# EAGLE design ConnectorHead_RPi (EAGLE 9.6.2)
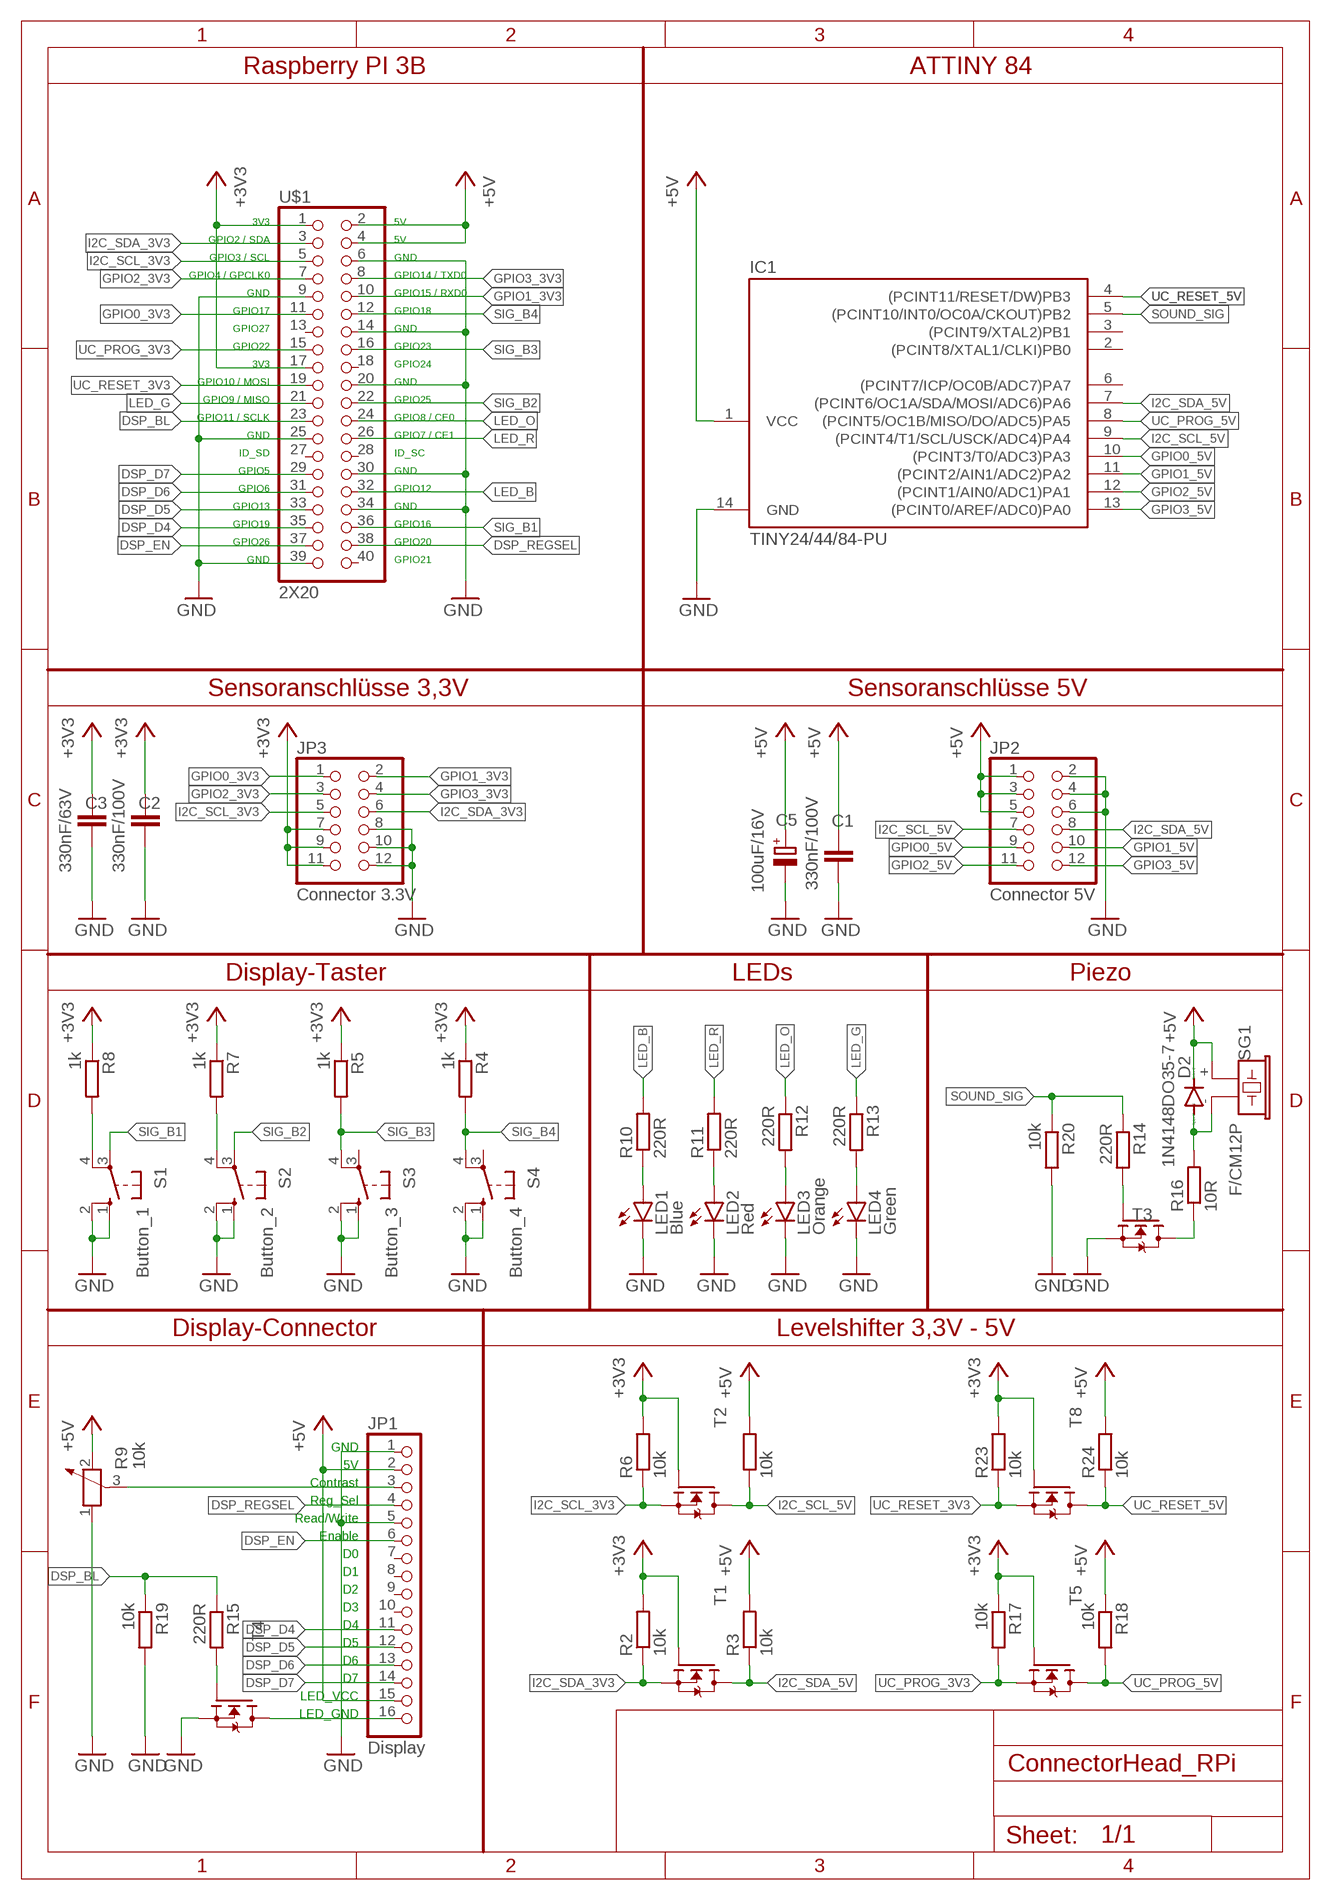
[diagram p0: schematic, sheet 1]

## Parts
C1  330nF/100V  C-EU075-042X103  [C075-042X103]
C2  330nF/100V  C-EU075-042X103  [C075-042X103]
C3  330nF/63V  C-EU050-035X075  [C050-035X075]
C5  100uF/16V  CPOL-EUE2.5-6_FLAT_DOWN  [E2,5-6_FLAT_DOWN]
D2  1N4148DO35-7  [DO35-7]
IC1  TINY24/44/84-PU  [DIL14]
JP1  Display  PINHD-1X16F1X16F  [1X16F]
JP2  Connector 5V  PINHD-2X6/90  [2X06/90]
JP3  Connector 3.3V  PINHD-2X6/90  [2X06/90]
LED1  Blue  LED5MM  [LED5MM]
LED2  Red  LED5MM  [LED5MM]
LED3  Orange  LED5MM  [LED5MM]
LED4  Green  LED5MM  [LED5MM]
R1  10k  R-EU_0309/V  [0309V]
R2  10k  R-EU_0309/V  [0309V]
R3  10k  R-EU_0309/V  [0309V]
R4  1k  R-EU_0309/V  [0309V]
R5  1k  R-EU_0309/V  [0309V]
R6  10k  R-EU_0309/V  [0309V]
R7  1k  R-EU_0309/V  [0309V]
R8  1k  R-EU_0309/V  [0309V]
R9  10k  POTENTIOMETER_PT-10  [PT-10]
R10  220R  R-EU_0309/V  [0309V]
R11  220R  R-EU_0309/V  [0309V]
R12  220R  R-EU_0309/V  [0309V]
R13  220R  R-EU_0309/V  [0309V]
R14  220R  R-EU_0309/V  [0309V]
R15  220R  R-EU_0309/V  [0309V]
R16  10R  R-EU_0309/V  [0309V]
R17  10k  R-EU_0309/V  [0309V]
R18  10k  R-EU_0309/V  [0309V]
R19  10k  R-EU_0309/V  [0309V]
R20  10k  R-EU_0309/V  [0309V]
R23  10k  R-EU_0309/V  [0309V]
R24  10k  R-EU_0309/V  [0309V]
S1  Button_1  10-XX  [B3F-10XX]
S2  Button_2  10-XX  [B3F-10XX]
S3  Button_3  10-XX  [B3F-10XX]
S4  Button_4  10-XX  [B3F-10XX]
SG1  F/CM12P  [F/CM12P]
T1  2N7000  [TO92]
T2  2N7000  [TO92]
T3  2N7000  [TO92]
T4  2N7000  [TO92]
T5  2N7000  [TO92]
T8  2N7000  [TO92]
U$1  2X20  [2X20]

## Nets
+3V3: C2.1 C3.1 JP3.7 JP3.9 JP3.11 R2.2 R4.1 R5.1 R6.2 R7.1 R8.1 R17.1 R23.2 T1.2(G) T2.2(G) T5.2(G) T8.2(G) U$1.1 U$1.17
+5V: C1.1 C5.+ D2.C IC1.1(VCC) JP1.2 JP1.15 JP2.1 JP2.3 JP2.5 R1.2 R3.2 R9.2 R18.1 R24.2 SG1.+ U$1.2 U$1.4
DSP_BL: R15.1 R19.1 U$1.23
DSP_BL_GND: JP1.16 T4.1(D)
DSP_CONTRAST: JP1.3 R9.3
DSP_D4: JP1.11 U$1.35
DSP_D5: JP1.12 U$1.33
DSP_D6: JP1.13 U$1.31
DSP_D7: JP1.14 U$1.29
DSP_EN: JP1.6 U$1.37
DSP_REGSEL: JP1.4 U$1.38
GND: C1.2 C2.2 C3.2 C5.- IC1.14(GND) JP1.1 JP1.5 JP2.2 JP2.4 JP2.6 JP3.8 JP3.10 JP3.12 LED1.K(C) LED2.K(C) LED3.K(C) LED4.K(C) R9.1 R19.2 R20.2 S1.1(S) S1.2(S1) S2.1(S) S2.2(S1) S3.1(S) S3.2(S1) S4.1(S) S4.2(S1) T3.3(S) T4.3(S) U$1.6 U$1.9 U$1.14 U$1.20 U$1.25 U$1.30 U$1.34 U$1.39
GPIO0_3V3: JP3.1 U$1.11
GPIO0_5V: IC1.10((PCINT3/T0/ADC3)PA3) JP2.9
GPIO1_3V3: JP3.2 U$1.10
GPIO1_5V: IC1.11((PCINT2/AIN1/ADC2)PA2) JP2.10
GPIO2_3V3: JP3.3 U$1.7
GPIO2_5V: IC1.12((PCINT1/AIN0/ADC1)PA1) JP2.11
GPIO3_3V3: JP3.4 U$1.8
GPIO3_5V: IC1.13((PCINT0/AREF/ADC0)PA0) JP2.12
I2C_SCL_3V3: JP3.5 R6.1 T2.3(S) U$1.5
I2C_SCL_5V: IC1.9((PCINT4/T1/SCL/USCK/ADC4)PA4) JP2.7 R1.1 T2.1(D)
I2C_SDA_3V3: JP3.6 R2.1 T1.3(S) U$1.3
I2C_SDA_5V: IC1.7((PCINT6/OC1A/SDA/MOSI/ADC6)PA6) JP2.8 R3.1 T1.1(D)
LED_B: R10.2 U$1.32
LED_G: R13.1 U$1.21
LED_O: R12.1 U$1.24
LED_R: R11.2 U$1.26
N$1: LED1.A R10.1
N$2: LED2.A R11.1
N$3: LED3.A R12.2
N$4: LED4.A R13.2
N$5: R16.1 T3.1(D)
N$6: D2.A R16.2 SG1.-
N$7: R14.2 T3.2(G)
N$8: R8.2 S1.4(P1)
N$9: R15.2 T4.2(G)
N$10: R7.2 S2.4(P1)
SIG_B1: S1.3(P) U$1.36
SIG_B2: S2.3(P) U$1.22
SIG_B3: R5.2 S3.4(P1) U$1.16
SIG_B4: R4.2 S4.4(P1) U$1.12
SOUND_SIG: IC1.5((PCINT10/INT0/OC0A/CKOUT)PB2) R14.1 R20.1
UC_PROG_3V3: R17.2 T5.3(S) U$1.15
UC_PROG_5V: IC1.8((PCINT5/OC1B/MISO/DO/ADC5)PA5) R18.2 T5.1(D)
UC_RESET_3V3: R23.1 T8.3(S) U$1.19
UC_RESET_5V: IC1.4((PCINT11/RESET/DW)PB3) R24.1 T8.1(D)
Unconnected: IC1.2((PCINT8/XTAL1/CLKI)PB0) IC1.3((PCINT9/XTAL2)PB1) IC1.6((PCINT7/ICP/OC0B/ADC7)PA7) JP1.7 JP1.8 JP1.9 JP1.10 S3.3(P) S4.3(P) U$1.13 U$1.18 U$1.27 U$1.28 U$1.40

## Notes on the sheet
- Raspberry PI 3B | ATTINY 84
- 3V3 | 5V
- GPIO2 / SDA | 5V
- GPIO3 / SCL | GND
- GPIO4 / GPCLK0 | GPIO14 / TXD0
- GND | GPIO15 / RXD0
- GPIO17 | GPIO18
- GPIO27 | GND
- GPIO22 | GPIO23
- 3V3 | GPIO24
- GPIO10 / MOSI | GND
- GPIO9 / MISO | GPIO25
- GPIO11 / SCLK | GPIO8 / CE0
- GND | GPIO7 / CE1
- ID_SD | ID_SC
- GPIO5 | GND
- GPIO6 | GPIO12
- GPIO13 | GND
- GPIO19 | GPIO16
- GPIO26 | GPIO20
- GND | GPIO21
- Sensoranschlüsse 3,3V | Sensoranschlüsse 5V
- Display-Taster | LEDs | Piezo
- Display-Connector | Levelshifter 3,3V - 5V
- GND
- 5V
- Contrast
- Reg_Sel
- Read/Write
- Enable
- D0
- D1
- D2
- D3
- D4
- D5
- D6
- D7
- LED_VCC
- LED_GND

## Library data of the parts
C1-C3 = rcl:C-EU: CAPACITOR, European symbol; SPICEPREFIX: C
C5 = rcl:CPOL-EU: POLARIZED CAPACITOR, European symbol
D2 = diode:1N4148: DIODE high speed (Philips)
IC1 = avr-7:TINY24/44/84
JP1 = pinhead:PINHD-1X16F: PIN HEADER
JP2 JP3 = pinhead:PINHD-2X6: PIN HEADER
LED1-LED4 = led:LED: LED OSRAM: - CHIPLED LG R971, LG N971, LY N971, LG Q971, LY Q971, LO R971, LY R971 LH N974, LH R974 LS Q976, LO Q976, LY Q976 LO Q996 - Hyper CHIPLED LW Q18S LB Q993, LB Q99A, LB R99A - SideLED LS A670, LO A670, LY A670, LG A670, LP A670 LB A673, LV A673, LT A673, LW A673 LH A674 LY A675 LS A676, LA A676, LO A676, LY A676, LW A676 LS A679, LY A679, LG A679 - Hyper Micro SIDELED® LS Y876, LA Y876, LO Y876, LY Y876 LT Y87S - SmartLED LW L88C, LW L88S LB L89C, LB L89S, LG L890 LS L89K, LO L89K, LY L89K LS L896, LA L896, LO L896, LY L896 - TOPLED LS T670, LO T670, LY T670, LG T670, LP T670 LSG T670, LSP T670, LSY T670, LOP T670, LYG T670 LG T671, LOG T671, LSG T671 LB T673, LV T673, LT T673, LW T673 LH T674 LS T676, LA T676, LO T676, LY T676, LB T676, LH T676, LSB T676, LW T676 LB T67C, LV T67C, LT T67C, LS T67K, LO T67K, LY T67K, LW E67C LS E67B, LA E67B, LO E67B, LY E67B, LB E67C, LV E67C, LT E67C LW T67C LS T679, LY T679, LG T679 LS T770, LO T770, LY T770, LG T770, LP T770 LB T773, LV T773, LT T773, LW T773 LH T774 LS E675, LA E675, LY E675, LS T675 LS T776, LA T776, LO T776, LY T776, LB T776 LHGB T686 LT T68C, LB T68C - Hyper Mini TOPLED® LB M676 - Mini TOPLED Santana® LG M470 LS M47K, LO M47K, LY M47K Source: http://www.osram.convergy.de LUXEON: - LUMILED® LXK2-PW12-R00, LXK2-PW12-S00, LXK2-PW14-U00, LXK2-PW14-V00 LXK2-PM12-R00, LXK2-PM12-S00, LXK2-PM14-U00 LXK2-PE12-Q00, LXK2-PE12-R00, LXK2-PE12-S00, LXK2-PE14-T00, LXK2-PE14-U00 LXK2-PB12-K00, LXK2-PB12-L00, LXK2-PB12-M00, LXK2-PB14-N00, LXK2-PB14-P00, LXK2-PB14-Q00 LXK2-PR12-L00, LXK2-PR12-M00, LXK2-PR14-Q00, LXK2-PR14-R00 LXK2-PD12-Q00, LXK2-PD12-R00, LXK2-PD12-S00 LXK2-PH12-R00, LXK2-PH12-S00 LXK2-PL12-P00, LXK2-PL12-Q00, LXK2-PL12-R00 Source: www.luxeon.com KINGBRIGHT: KA-3528ASYC Source: www.kingbright.com
R1-R8 R10-R20 R23 R24 = rcl:R-EU_: RESISTOR, European symbol; SPICEPREFIX: R
R9 = rcl:POTENTIOMETER_: Potentiometer; SPICEMODEL: POT; SPICEPREFIX: X
S1-S4 = switch-omron:10-XX: OMRON SWITCH; MPN: B3F-1000; OC_FARNELL: 176432; OC_NEWARK: 36M3542
SG1 = buzzer:F/CM12P: BUZZER Source: Buerklin; OC_FARNELL: unknown; OC_NEWARK: unknown
T1-T5 T8 = 2N7000:2N7000: Check availability <https://pricing.snapeda.com/parts/2N7000/STMicroelectronics/view-part?ref=eda>; AVAILABILITY: In Stock; DESCRIPTION: N-Channel 60 V 350mA (Tc) 1W (Tc) Through Hole TO-92-3; MF: STMicroelectronics; MP: 2N7000; PACKAGE: E-PKG AXIAL-LEADED-2 ON Semiconductor; PRICE: None; PURCHASE-URL: https://pricing.snapeda.com/search/part/2N7000/?ref=eda
U$1 = Fischer-Pinhead:2X20

## Board
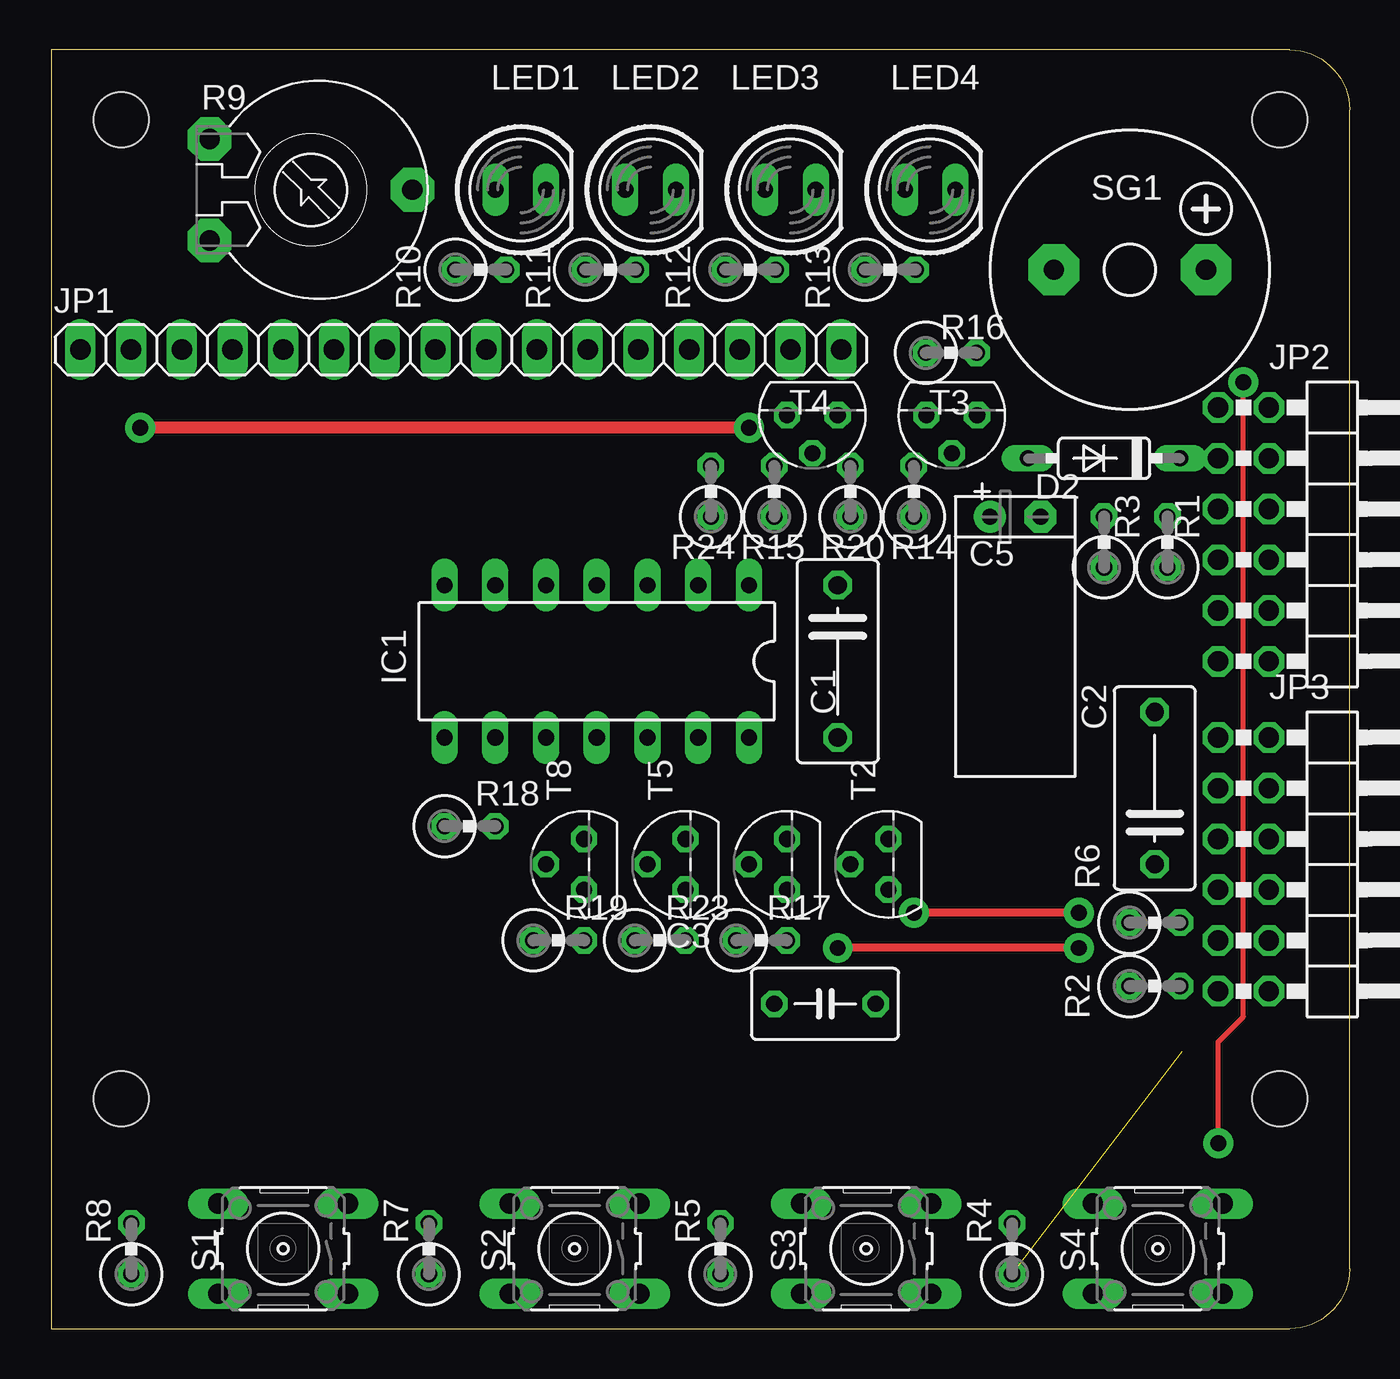
[diagram p1: board, top side]
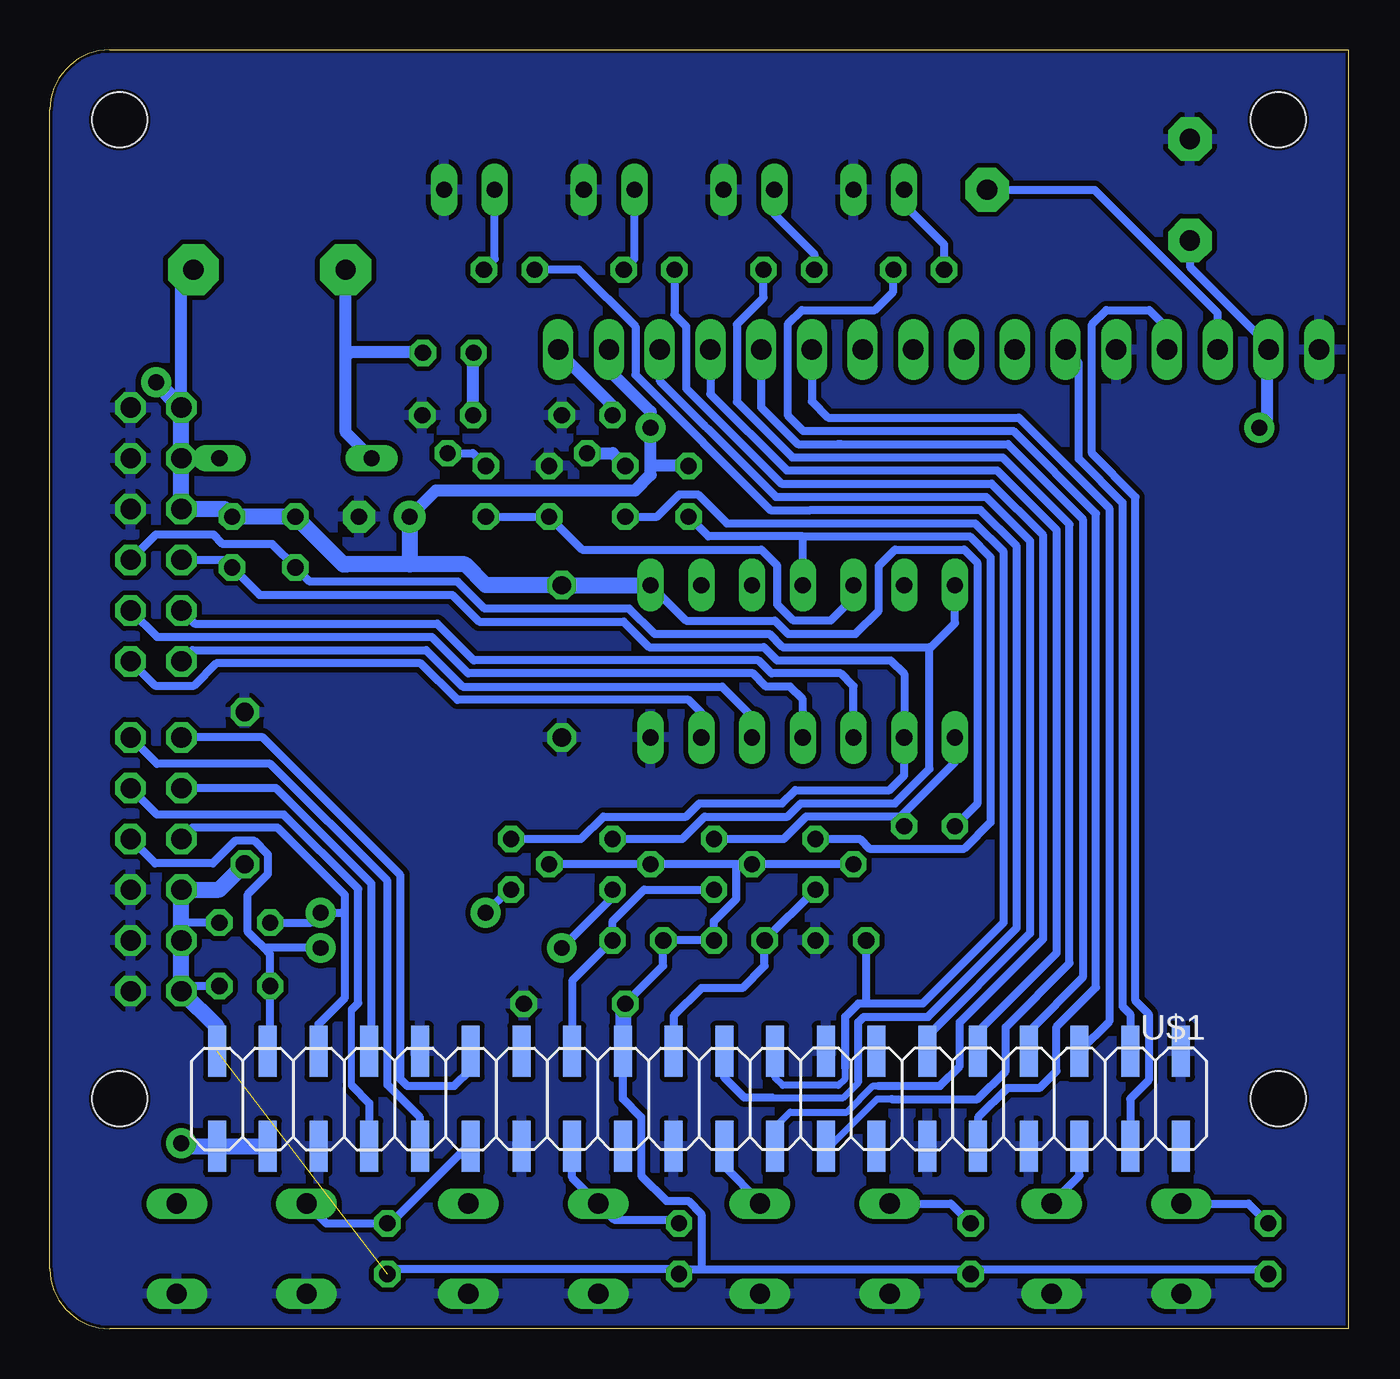
[diagram p2: board, bottom side, seen from below]

Size 65 x 64 mm. Coordinates in mm from the lower left corner, seen from the top.
Outline: 62,64 0,64 0,0 62,0 arc90 65,3 65,61 arc90 62,64
Copper layers (1*16): Top 0.035mm / dielectric 1.5mm / Bottom 0.035mm
Design rules "default *": minimum track width 10mil, minimum drill 0.35mm, track to track 10mil, track to pad 10mil, pad to pad 10mil, via to via 10mil, smd to smd 10mil, copper to edge 6mil, drill to drill 10mil, minimum pad ring 10mil, minimum via ring 8mil, stop-mask expansion 4mil, vias tented up to drill 0mil, thermal gap 10mil
Holes 2.75 mm at 61.5,60.5 61.5,11.5 3.5,60.5 3.5,11.5
bKeepout: area 58.5,57.5 to 64.5,63.5; area 58.5,8.5 to 64.5,14.5; area 0.5,8.5 to 6.5,14.5; area 0.5,57.5 to 6.5,63.5

### Footprints (pad centres in the part's own frame; a part is rotated, then mirrored left to right if it is on the bottom)
C075-042X103 = drill 0.914 octagon: 1 -3.81,0; 2 3.81,0
C050-035X075 = drill 0.813 octagon: 1 -2.54,0; 2 2.54,0
E2,5-6_FLAT_DOWN = drill 0.813 pad 1.6: + -1.27,0 | drill 0.813 pad 1.6 octagon: - 1.27,0
DO35-7 = drill 0.813 long: A 3.81,0; C -3.81,0
DIL14 = drill 0.813 long: 1 -7.62,-3.81; 2 -5.08,-3.81; 3 -2.54,-3.81; 4 0,-3.81; 5 2.54,-3.81; 6 5.08,-3.81; 7 7.62,-3.81; 8 7.62,3.81; 9 5.08,3.81; 10 2.54,3.81; 11 0,3.81; 12 -2.54,3.81; 13 -5.08,3.81; 14 -7.62,3.81
1X16F = drill 1.016 long: 1 -19.05,0; 2 -16.51,0; 3 -13.97,0; 4 -11.43,0; 5 -8.89,0; 6 -6.35,0; 7 -3.81,0; 8 -1.27,0; 9 1.27,0; 10 3.81,0; 11 6.35,0; 12 8.89,0; 13 11.43,0; 14 13.97,0; 15 16.51,0; 16 19.05,0
2X06/90 = drill 1.016 octagon: 1 -6.35,-6.35; 2 -6.35,-3.81; 3 -3.81,-6.35; 4 -3.81,-3.81; 5 -1.27,-6.35; 6 -1.27,-3.81; 7 1.27,-6.35; 8 1.27,-3.81; 9 3.81,-6.35; 10 3.81,-3.81; 11 6.35,-6.35; 12 6.35,-3.81
LED5MM = drill 0.813 long: A -1.27,0; K 1.27,0
0309V = drill 0.813 octagon: 1 -1.27,0; 2 1.27,0
PT-10 = drill 1.016 pad 2.184 octagon: 1 -2.54,-5.08; 2 2.54,-5.08; 3 0,5.08
B3F-10XX = drill 1.016 long: 1 -3.251,2.261; 2 3.251,2.261; 3 -3.251,-2.261; 4 3.251,-2.261
F/CM12P = drill 1.016 pad 2.54 octagon: + 3.81,0; - -3.81,0
TO92 = drill 0.813 octagon: 1 1.27,0; 2 0,1.905; 3 -1.27,0
2X20 = smd 0.9 x 2.55: 1 -24.13,2.375; 2 -24.13,-2.375; 3 -21.59,2.375; 4 -21.59,-2.375; 5 -19.05,2.375; 6 -19.05,-2.375; 7 -16.51,2.375; 8 -16.51,-2.375; 9 -13.97,2.375; 10 -13.97,-2.375; 11 -11.43,2.375; 12 -11.43,-2.375; 13 -8.89,2.375; 14 -8.89,-2.375; 15 -6.35,2.375; 16 -6.35,-2.375; 17 -3.81,2.375; 18 -3.81,-2.375; 19 -1.27,2.375; 20 -1.27,-2.375; 21 1.27,2.375; 22 1.27,-2.375; 23 3.81,2.375; 24 3.81,-2.375; 25 6.35,2.375; 26 6.35,-2.375; 27 8.89,2.375; 28 8.89,-2.375; 29 11.43,2.375; 30 11.43,-2.375; 31 13.97,2.375; 32 13.97,-2.375; 33 16.51,2.375; 34 16.51,-2.375; 35 19.05,2.375; 36 19.05,-2.375; 37 21.59,2.375; 38 21.59,-2.375; 39 24.13,2.375; 40 24.13,-2.375

### Placement (x,y rotation side)
C1  39.37,33.4 270 top
C2  55.24,27.05 90 top
C3  38.73,16.25 0 top
C5  48.26,40.64 0 top
D2  52.7,43.56 180 top
IC1  27.3,33.4 180 top
JP1  20.5,49 0 top
JP2  64.77,39.75 270 top
JP3  64.77,23.24 270 top
LED1  23.5,57 0 top
LED2  30,57 0 top
LED3  37,57 0 top
LED4  44,57 0 top
R1  55.88,39.37 90 top
R2  55.24,17.14 0 top
R3  52.7,39.37 90 top
R4  48.1,4 90 top
R5  33.5,4 90 top
R6  55.24,20.32 0 top
R7  18.9,4 90 top
R8  4,4 90 top
R9  13,57 270 top
R10  21.5,53 0 top
R11  28,53 0 top
R12  35,53 0 top
R13  42,53 0 top
R14  43.18,41.91 90 top
R15  36.2,41.91 90 top
R16  45.05,48.84 0 top
R17  35.56,19.43 0 top
R18  20.95,25.14 0 top
R19  25.4,19.43 0 top
R20  40.01,41.91 90 top
R23  30.48,19.43 0 top
R24  33.02,41.91 90 top
S1  11.6,4 180 top
S2  26.2,4 180 top
S3  40.8,4 180 top
S4  55.4,4 180 top
SG1  54,53 0 top
T1  36.83,23.24 90 top
T2  41.91,23.24 90 top
T3  45.09,45.72 180 top
T4  38.1,45.72 180 top
T5  31.75,23.24 90 top
T8  26.67,23.24 90 top
U$1  32.5,11.5 0 bottom

### Tracks (layer width: path | path; a pad name or v marks a point on that pad's centre or on a via)
+3V3  (1 unrouted)
  Bottom 0.406: R4.1 47.87,2.96 33.73,2.96 R5.1 33.27,2.96 32.38,2.96 | 32.38,2.96 19.13,2.96 R7.1 18.67,2.96 4.23,2.96 R8.1 | 32.38,2.96 32.38,5.73 33.04,6.39 34.13,6.39 35.4,7.66 35.4,10.59 36.31,11.5 U$1.17 | T8.2 T5.2 30.48,23.24 | 30.48,23.24 T1.2 T2.2 | C3.1 34.29,18.16 R17.1 R23.2 31.75,20.39 30.63,21.51 30.63,23.09 30.48,23.24 | R2.2 58.16,17.14 JP3.11 | R6.2 58.42,20.32
  Bottom 0.813: C2.1 56.52,21.97 JP3.7 58.42,20.32 JP3.9 JP3.11 56.63,15.1 U$1.1 | C3.1 36.31,16.14 U$1.17
+5V  (via drill 0.8 pad 1.5)
  Top 0.254: v58.42,9.27 58.42,14.35 59.69,15.62 v59.69,47.37
  Top 0.61: v4.45,45.09 4.48,45.12 4.52,45.09 v34.92,45.09
  Bottom 0.406: R9.2 7.92,53.15 3.99,49.22 JP1.2 | IC1.1 33.15,35.43 28.7,35.43 28.04,34.77 24.66,34.77 23.5,35.94 23.5,38.18 22.69,38.99 19.22,38.99 18.57,38.33 18.57,26.26 R18.1
  Bottom 0.61: JP2.1 58.42,52.39 SG1.+ | JP1.2 4.05,48.94 4.05,45.48 v4.45,45.09 | C5.+ 45.67,41.96 35.69,41.96 34.92,42.73 34.92,43.18 | 34.92,43.18 v34.92,45.09 34.92,45.89 37.01,47.98 JP1.15 | R24.2 34.92,43.18
  Bottom 0.813: JP2.3 JP2.5 56.26,41.02 R1.2 R3.2 50.32,38.25 50.16,38.25 46.99,38.25 | JP2.3 JP2.1 v59.69,47.37 | JP2.3 D2.C | IC1.1 C1.1 43.18,37.21 44.22,38.25 46.99,38.25 | v58.42,9.27 58.27,9.12 U$1.2 U$1.4 | C5.+ 46.99,38.25
DSP_BL
  Bottom 0.356: 25.18,13.08 25.18,12.51 25.52,12.17 28.3,12.17 28.69,12.56 U$1.23
  Bottom 0.406: 25.18,13.08 25.18,15.61 24.52,16.27 24.13,16.27 | 24.13,16.27 21.31,16.27 17.25,20.33 17.25,38.88 18.68,40.31 31.11,40.31 32.56,41.76 33.48,41.76 34.6,40.64 R15.1 | R19.1 24.13,16.27
DSP_BL_GND
  Bottom 0.61: T4.1 36.83,46.19 39.55,48.91 JP1.16
DSP_CONTRAST
  Bottom 0.406: R9.3 12.7,57 6.53,50.83 JP1.3
DSP_D4
  Bottom 0.406: U$1.35 11.96,15.36 11.96,41.07 16.49,45.59 26.04,45.59 26.85,46.41 JP1.11
DSP_D5
  Bottom 0.406: U$1.33 15.99,14.87 13.28,17.58 13.28,40.52 17.03,44.27 25.4,44.27 25.54,44.27 27.56,44.27 29.39,46.1 JP1.12
DSP_D6
  Bottom 0.406: U$1.31 18.53,14.87 14.61,18.8 14.61,39.98 17.58,42.95 26.04,42.95 26.09,42.95 28.11,42.95 31.93,46.78 JP1.13
DSP_D7
  Bottom 0.406: U$1.29 21.07,14.64 15.93,19.79 15.93,39.43 18.13,41.63 28.65,41.63 32.06,45.04 32.25,45.22 34.47,47.45 JP1.14
DSP_EN
  Bottom 0.406: JP1.6 13.49,48.34 13.49,43.53 11.3,41.34 11.3,16.13 10.91,15.73 U$1.37
DSP_REGSEL
  Bottom 0.406: JP1.4 9.07,50.09 9.96,50.98 12.12,50.98 12.83,50.27 12.83,43.8 10.64,41.62 10.64,16.4 9.98,15.74 9.98,12.43 10.91,11.5 U$1.38
GND
  pour Bottom: 0,0 65,0 65,64 0,64
GPIO0_3V3
  Bottom 0.406: JP3.1 54.35,29.59 47.44,22.68 47.44,12.48 47.11,12.14 44.75,12.14 43.93,12.96 U$1.11
GPIO0_5V
  Bottom 0.406: IC1.10 24.77,32.16 25.4,32.79 28.86,32.79 29.52,33.45 43.78,33.45 45.61,35.28 57.76,35.28 JP2.9
GPIO1_3V3
  Bottom 0.406: JP3.2 59.64,28.27 53.96,28.27 48.1,22.41 48.1,12.2 46.47,10.57 U$1.10
GPIO1_5V
  Bottom 0.406: IC1.11 27.3,31.5 27.94,32.13 29.14,32.13 29.8,32.79 44.05,32.79 45.88,34.62 59.64,34.62 JP2.10
GPIO2_3V3
  Bottom 0.406: JP3.3 53.68,27.05 48.91,22.28 48.91,15 48.9,14.98 48.9,13.99 U$1.7
GPIO2_5V
  Bottom 0.406: IC1.12 29.84,30.64 31.34,32.13 44.33,32.13 46.16,33.96 57.86,33.96 JP2.11
GPIO3_3V3
  Bottom 0.356: 49.89,12.17 49.89,15.96
  Bottom 0.406: JP3.4 59.64,25.73 53.29,25.73 49.57,22.01 49.57,16.29 49.89,15.96 | 49.89,12.17 49.01,11.29 U$1.8
GPIO3_5V
  Bottom 0.406: IC1.13 32.38,30.84 33.02,31.47 44.6,31.47 46.43,33.3 56.67,33.3 57.78,32.18 59.74,32.18 JP2.12
I2C_SCL_3V3  (via drill 0.8 pad 1.5)
  Top 0.406: v51.44,20.8 v43.18,20.8
  Bottom 0.406: JP3.5 57.86,25.07 53.6,25.07 50.23,21.69 50.23,20.95 | U$1.5 51.55,15.24 50.23,16.56 50.23,20.95 | v43.18,20.8 42.01,21.97 T2.3 | R6.1 51.92,20.32 v51.44,20.8 50.38,20.8 50.23,20.95
I2C_SCL_5V
  Bottom 0.406: T2.1 38.41,24.51 37.29,25.63 33.15,25.63 32.49,26.29 28.34,26.29 27.68,26.95 22.96,26.95 22.23,27.68 IC1.9 22.23,32.77 22.91,33.45 28.59,33.45 29.25,34.11 35,34.11 36.27,35.38 43.51,35.38 44.85,36.73 54.51,36.73 R1.1 56.26,38.48 JP2.7
I2C_SDA_3V3  (via drill 0.8 pad 1.5)
  Top 0.406: v51.44,19.05 v39.37,19.05
  Bottom 0.406: JP3.6 59.74,23.29 56.85,23.29 55.73,24.41 54.76,24.41 54.08,23.72 54.08,22.76 55.09,21.74 55.09,19.86 54.77,19.53 54.29,19.05 | v39.37,19.05 36.83,21.59 T1.3 | U$1.3 53.98,13.99 R2.1 53.98,18.74 54.29,19.05 | v51.44,19.05 54.29,19.05
I2C_SDA_5V
  Bottom 0.406: JP2.8 59.69,39.75 56.83,39.75 56.34,39.27 53.87,39.27 R3.1 51.99,37.39 44.58,37.39 43.23,36.04 36,36.04 34.73,34.77 28.98,34.77 28.32,34.11 20.95,34.11 | 20.95,34.11 20.88,34.11 19.68,35.3 IC1.7 | T1.1 33.33,24.51 32.21,25.63 28.07,25.63 27.41,26.29 22.69,26.29 20.95,28.02 20.95,34.11
LED_B
  Bottom 0.406: R10.2 22.77,51.91 23.69,50.98 27.36,50.98 28.07,50.27 28.07,45.72 27.28,44.93 16.76,44.93 12.62,40.8 12.62,17.08 14.61,15.1 14.61,12.89 15.46,12.03 17.07,12.03 18.53,10.57 U$1.32
LED_G
  Bottom 0.356: 24.52,12.45 24.52,12.31 25.27,11.56 28.83,11.56
  Bottom 0.406: R13.1 38.52,53 35.69,50.16 35.69,47.73 28.93,40.97 26.91,40.97 26.67,40.97 18.4,40.97 16.59,39.15 16.59,20.06 21.04,15.61 24.25,15.61 24.52,15.34 24.52,12.45 | 28.83,11.56 30.23,11.56 31.23,12.56 U$1.21
LED_O
  Bottom 0.356: 23.5,12.14 23.79,12.14 25.1,10.83 27.94,10.83 28.69,10.08 U$1.24
  Bottom 0.406: 23.5,12.14 20.43,12.14 19.44,13.14 19.44,15.34 15.27,19.51 15.27,39.7 17.85,42.29 28.38,42.29 33.15,47.06 33.15,50.16 33.73,50.75 R12.1
LED_R
  Bottom 0.356: 22.86,11.48 23.59,11.48 25.95,9.12 U$1.26
  Bottom 0.406: R11.2 29.27,51.61 30.61,50.27 30.61,46.39 27.83,43.61 17.31,43.61 13.95,40.25 13.95,18.29 17.14,15.09 17.14,12.89 18.55,11.48 22.86,11.48
N$1
  Bottom 0.406: LED1.A 22.23,56.26 20.23,54.27 R10.1
N$2
  Bottom 0.406: R11.1 26.73,53.78 28.73,55.78 LED2.A
N$3
  Bottom 0.406: R12.2 35.73,53.54 LED3.A
N$4
  Bottom 0.406: R13.2 42.73,53.54 LED4.A
N$5
  Bottom 0.61: T3.1 43.81,48.81 R16.1
N$6
  Bottom 0.61: D2.A 50.19,44.85 50.19,48.64 | 50.19,48.64 SG1.- | 50.19,48.64 49.97,48.86 46.34,48.86 R16.2
N$7
  Bottom 0.406: T3.2 43.81,43.81 R14.2
N$8
  Bottom 0.406: S1.4 4.99,6.26 R8.2
N$9
  Bottom 0.61: T4.2 36.83,43.81 R15.2
N$10
  Bottom 0.406: S2.4 19.89,6.26 R7.2
SIG_B1
  Bottom 0.406: U$1.36 13.45,7.66 S1.3
SIG_B2
  Bottom 0.406: U$1.22 31.23,8.12 29.45,6.34 S2.3
SIG_B3
  Bottom 0.406: R5.2 33.69,5.46 36.75,5.46 S3.4 38.85,7.56 U$1.16
SIG_B4
  Bottom 0.406: S4.4 51.16,5.27 R4.2 47.95,5.27 44.1,9.12 U$1.12
SOUND_SIG
  Bottom 0.406: IC1.5 24.77,36.58 25.91,35.43 27.77,35.43 28.57,36.24 28.57,38.18 29.38,38.99 38.35,38.99 R20.1 R14.1
UC_PROG_3V3
  Bottom 0.406: T5.3 35.25,21.97 36.83,20.39 R17.2 38.85,17.41 U$1.15
UC_PROG_5V
  Bottom 0.406: T5.1 28.25,24.51 27.13,25.63 22.41,25.63 22.23,25.82 | IC1.8 19.68,28.36 22.23,25.82 | R18.2 22.23,25.82
UC_RESET_3V3
  Bottom 0.406: T8.3 R23.1 29.21,18.16 30.33,17.04 32.38,17.04 33.77,15.66 U$1.19
UC_RESET_5V
  Bottom 0.406: IC1.4 27.3,39.65 | 27.3,39.65 18.95,39.65 17.91,38.61 17.91,25.34 19.22,24.03 23.97,24.03 24.45,24.51 T8.1 | 27.3,39.65 32.03,39.65 R24.1